# Altium schematic sheet Voltage Source.SchDoc
size A4; SheetNumber: 3; SheetTotal: 6; ProjectTitle: PD_SMARTKEY_EMN-EVAN_V2
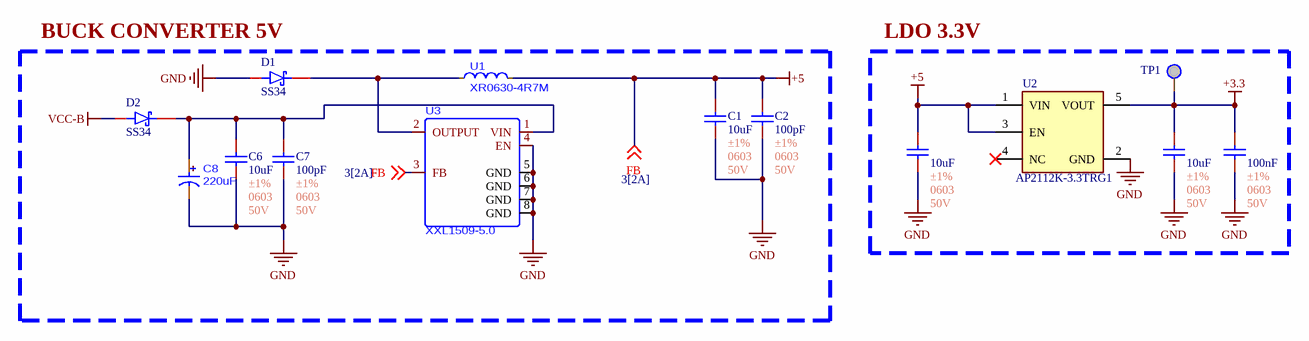
[diagram p0: Voltage Source.SchDoc]

## Parts
C1  10uF  Tolerance: ±1%  Package: 0603  Voltage Rating: 50V  [C0603]
C2  100pF  Tolerance: ±1%  Package: 0603  Voltage Rating: 50V  [C0603]
C3  10uF  Tolerance: ±1%  Package: 0603  Voltage Rating: 50V  [C0603]
C4  10uF  Tolerance: ±1%  Package: 0603  Voltage Rating: 50V  [C0603]
C5  100nF  Tolerance: ±1%  Package: 0603  Voltage Rating: 50V  [C0603]
C6  10uF  Tolerance: ±1%  Package: 0603  Voltage Rating: 50V  [C0603]
C7  100pF  Tolerance: ±1%  Package: 0603  Voltage Rating: 50V  [C0603]
C8  220uF  [C_220uF_35V_SMD]
D1  SS34  [SS34]
D2  SS34  [SS34]
TP1  TP  [TP]  (value not drawn)
U1  XR0630-4R7M  [SMD,7x6.6mm]
U2  AP2112K-3.3TRG1  [SOT23-5]
U3  XXL1509-5.0  [XXL1509-5.0]

## Blocks framed on the sheet
BUCK CONVERTER 5V: C1 C2 C6-C8 D1 D2 U1 U3
LDO 3.3V: C3-C5 TP1 U2

## Nets
+3.3: C4.1 C5.1 TP1.1 U2.5(VOUT)
+5: C1.1 C2.1 C3.1 U1.2(F) U2.1(VIN) U2.3(EN) U3.3(FB) ; off-sheet FB  [also labelled FB]
GND: C1.2 C2.2 C3.2 C4.2 C5.2 C6.2 C7.2 C8.2 D1.2 U2.2(GND) U3.4(EN) U3.5(GND) U3.6(GND) U3.7(GND) U3.8(GND)
VCC-B: D2.2
NetC6_1: C6.1 C7.1 C8.1 D2.1 U3.1(VIN)
NetD1_1: D1.1 U1.1(S) U3.2(OUTPUT)

Not connected (* = marked no-connect by the designer): U2 4(NC)*

## Notes on the sheet
- Author:
- Title:
- Size:
- A4
- Project:
- Approved:
- Revision:
- Modified Date:
- CONFIDENTIAL
- Date:
- SW Version:

## Library data of the parts
C1 C6 = C0603_10uF_±1%: Manufacturer: YAGEO; Mfr. Part #: CC0402FRNPO9BN100; LCSC Part #: C513681; Link: https://www.lcsc.com/product-detail/C513681.html?s_z=n_capital%2520yageo%252010pF%25200402; Capacitance: 10uF
C2 C7 = C0603_100pF_±1%: Manufacturer: YAGEO; Mfr. Part #: CC0402FRNPO9BN100; LCSC Part #: C513681; Link: https://www.lcsc.com/product-detail/C513681.html?s_z=n_capital%2520yageo%252010pF%25200402; Capacitance: 100pF
C3 C4 = C0603_10uF_±1%: 50V 10pF NP0 ±1% 0402 Multilayer Ceramic Capacitors MLCC - SMD/SMT ROHS; Manufacturer: YAGEO; Mfr. Part #: CC0402FRNPO9BN100; LCSC Part #: C513681; Link: https://www.lcsc.com/product-detail/C513681.html?s_z=n_capital%2520yageo%252010pF%25200402; Capacitance: 10uF
C5 = C0603_100nF_±1%: 50V 10pF NP0 ±1% 0402 Multilayer Ceramic Capacitors MLCC - SMD/SMT ROHS; Manufacturer: YAGEO; Mfr. Part #: CC0402FRNPO9BN100; LCSC Part #: C513681; Link: https://www.lcsc.com/product-detail/C513681.html?s_z=n_capital%2520yageo%252010pF%25200402; Capacitance: 100nF
C8 = C_220uF_35V_SMD: CAP ALUM 220uF ±20% 35V SMD; Manufacturer: ROQANG; Mfr. Part #: RVT1V221M0810; LCSC Part #: C72498; Package: SMD,D8xL10.2mm; Link: https://www.lcsc.com/product-detail/C72498.html?s_z=n_q_t_220u%252035v&spm=wm.fly.bg.0.xh___wm.ssy.tc.0.tz&lcsc_vid=FlRcBlcDRFNZAlJQT1RZBVJSEVFcX11eRVQPBFEHFgAxVlNeT1ReUlJRRFFYVTsOAxUeFF5JWBYZEEoKFBINSQcJGk4NBhADEA4cHktfT1FADxALGw%3D%3D
D1 D2 = SS34: 40V Independent 3A 550mV@3A SMA(DO-214AC) Schottky Diodes ROHS; Manufacturer: MDD(Microdiode Semiconductor); Mfr. Part #: SS34; LCSC Part #: C8678; Package: SMA(DO-214AC); Voltage - DC Reverse(Vr): 40V; Current - Rectified: 3A; Link: https://www.lcsc.com/product-detail/C8678.html?s_z=n_SS34
U1 = FIXED IND 4.7uH 6A 33mΩ SMD,0630: Manufacturer: XR; MPN: XR0630-4R7M; LCSC Part #: C5307631; Packaging: SMD,7x6.6mm; Link: https://www.lcsc.com/product-detail/C5307631.html?s_z=n_q_t_INDUCTOR%25200630&spm=wm.fly.bg.0.xh___wm.ssy.tc.0.tz&lcsc_vid=FFlaVlZURFlbX1EAE1lbUlZfQwdeBlBRQ1VZBFdQQwUxVlNeRlRfU1ZRQlNZXzsOAxUeFF5JWBYZEEoKFBINSQcJGk4eFQsCAgIaSgADAwAHC0slQ1ZXV1NWWQkaCgg%3D
U2 = AP2112K-3.3TRG1: Linear Voltage Regulator IC Positive Fixed 1 Output 600mA SOT23-5; MF: Diodes Inc.; Value: *; Purchase-URL: https://pricing.snapeda.com/search/part/AP2112K-3.3TRG1/?ref=eda; Package: SOT-753 Diodes Inc.; Availability: In Stock; Check_prices: https://www.snapeda.com/parts/AP2112K-3.3TRG1/Diodes+Inc./view-part/?ref=eda; Price: None; SnapEDA_Link: https://www.snapeda.com/parts/AP2112K-3.3TRG1/Diodes+Inc./view-part/?ref=snap; MP: AP2112K-3.3TRG1
U3 = XXL1509-5.0: 150KHz 3A PWM Buck DC/DC Converter; Manufacturer: UMW; MPN: XXL1509-5.0; LCSC Part #: C42376977; Packaging: SOP-8; Link: https://www.lcsc.com/product-detail/C42376977.html?s_z=n_q_xl1509&spm=wm.fly.bg.0.xh&lcsc_vid=FlRcBlcDRFNZAlJQT1RZBVJSEVFcX11eRVQPBFEHFgAxVlNeT1VdVlFURVJWXjsOAxUeFF5JWBYZEEoKFBINSQcJGk4eFQsCAgIaSgADAwAHC0slRVheUFFQQE8GEwkK